# Altium schematic sheet S06_SOM2_C_D.SchDoc: SOM2 C & D
size 381 x 241 mm; SheetNumber: 6; SheetTotal: 12
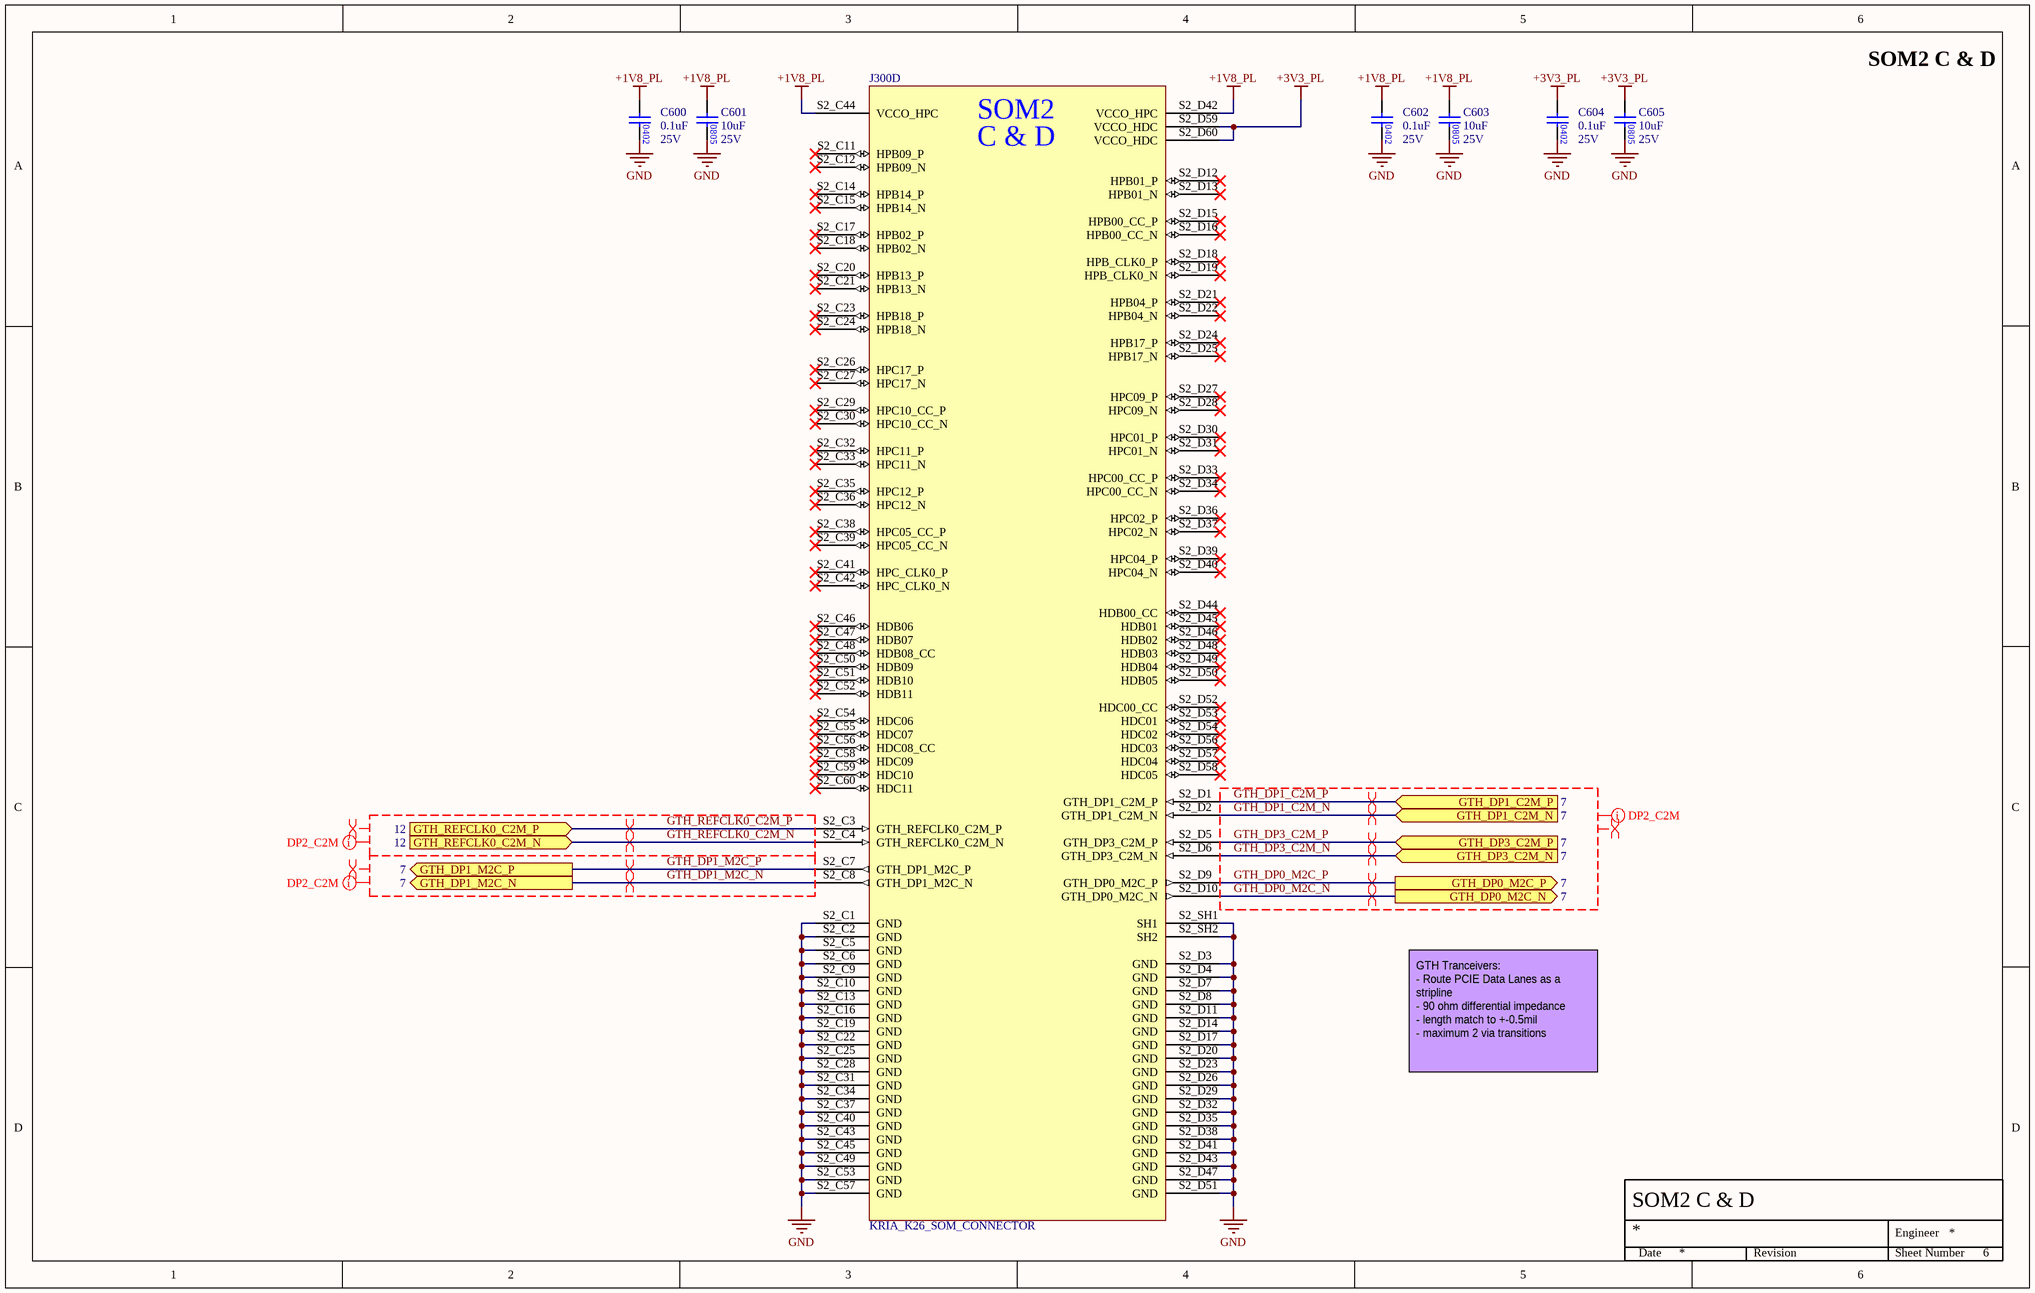
[diagram p0: S06_SOM2_C_D.SchDoc]

## Parts
C600  value 0.1uF  Voltage Rating: 25V  [CAP0402]  (hidden comment: CAP_0402)
C601  value 10uF  Voltage Rating: 25V  [CAP0805]  (hidden comment: CAP_0805)
C602  value 0.1uF  Voltage Rating: 25V  [CAP0402]  (hidden comment: CAP_0402)
C603  value 10uF  Voltage Rating: 25V  [CAP0805]  (hidden comment: CAP_0805)
C604  value 0.1uF  Voltage Rating: 25V  [CAP0402]  (hidden comment: CAP_0402)
C605  value 10uF  Voltage Rating: 25V  [CAP0805]  (hidden comment: CAP_0805)
J300  KRIA_K26_SOM_CONNECTOR  [KRIA_K26_SOM]  (part D of 4)

## Ports
GTH_DP0_M2C_N (out, see 7), GTH_DP0_M2C_P (out, see 7), GTH_DP1_C2M_N (in, see 7), GTH_DP1_C2M_P (in, see 7), GTH_DP1_M2C_N (out, see 7), GTH_DP1_M2C_P (out, see 7), GTH_DP3_C2M_N (in, see 7), GTH_DP3_C2M_P (in, see 7), GTH_REFCLK0_C2M_N (in, see 12), GTH_REFCLK0_C2M_P (in, see 12)

## Nets
+1V8_PL: C600.1 C601.1 C602.1 C603.1 J300.S2_C44(VCCO_HPC) J300.S2_D42(VCCO_HPC)
+3V3_PL: C604.1 C605.1 J300.S2_D59(VCCO_HDC) J300.S2_D60(VCCO_HDC)
GND: C600.2 C601.2 C602.2 C603.2 C604.2 C605.2 J300.S2_C1(GND) J300.S2_C2(GND) J300.S2_C5(GND) J300.S2_C6(GND) J300.S2_C9(GND) J300.S2_C10(GND) J300.S2_C13(GND) J300.S2_C16(GND) J300.S2_C19(GND) J300.S2_C22(GND) J300.S2_C25(GND) J300.S2_C28(GND) J300.S2_C31(GND) J300.S2_C34(GND) J300.S2_C37(GND) J300.S2_C40(GND) J300.S2_C43(GND) J300.S2_C45(GND) J300.S2_C49(GND) J300.S2_C53(GND) J300.S2_C57(GND) J300.S2_D3(GND) J300.S2_D4(GND) J300.S2_D7(GND) J300.S2_D8(GND) J300.S2_D11(GND) J300.S2_D14(GND) J300.S2_D17(GND) J300.S2_D20(GND) J300.S2_D23(GND) J300.S2_D26(GND) J300.S2_D29(GND) J300.S2_D32(GND) J300.S2_D35(GND) J300.S2_D38(GND) J300.S2_D41(GND) J300.S2_D43(GND) J300.S2_D47(GND) J300.S2_D51(GND) J300.S2_SH1(SH1) J300.S2_SH2(SH2)
GTH_DP0_M2C_N: J300.S2_D10(GTH_DP0_M2C_N) ; port GTH_DP0_M2C_N
GTH_DP0_M2C_P: J300.S2_D9(GTH_DP0_M2C_P) ; port GTH_DP0_M2C_P
GTH_DP1_C2M_N: J300.S2_D2(GTH_DP1_C2M_N) ; port GTH_DP1_C2M_N
GTH_DP1_C2M_P: J300.S2_D1(GTH_DP1_C2M_P) ; port GTH_DP1_C2M_P
GTH_DP1_M2C_N: J300.S2_C8(GTH_DP1_M2C_N) ; port GTH_DP1_M2C_N
GTH_DP1_M2C_P: J300.S2_C7(GTH_DP1_M2C_P) ; port GTH_DP1_M2C_P
GTH_DP3_C2M_N: J300.S2_D6(GTH_DP3_C2M_N) ; port GTH_DP3_C2M_N
GTH_DP3_C2M_P: J300.S2_D5(GTH_DP3_C2M_P) ; port GTH_DP3_C2M_P
GTH_REFCLK0_C2M_N: J300.S2_C4(GTH_REFCLK0_C2M_N) ; port GTH_REFCLK0_C2M_N
GTH_REFCLK0_C2M_P: J300.S2_C3(GTH_REFCLK0_C2M_P) ; port GTH_REFCLK0_C2M_P

Not connected (* = marked no-connect by the designer): J300 S2_C11(HPB09_P)* S2_C12(HPB09_N)* S2_C14(HPB14_P)* S2_C15(HPB14_N)* S2_C17(HPB02_P)* S2_C18(HPB02_N)* S2_C20(HPB13_P)* S2_C21(HPB13_N)* S2_C23(HPB18_P)* S2_C24(HPB18_N)* S2_C26(HPC17_P)* S2_C27(HPC17_N)* S2_C29(HPC10_CC_P)* S2_C30(HPC10_CC_N)* S2_C32(HPC11_P)* S2_C33(HPC11_N)* S2_C35(HPC12_P)* S2_C36(HPC12_N)* S2_C38(HPC05_CC_P)* S2_C39(HPC05_CC_N)* S2_C41(HPC_CLK0_P)* S2_C42(HPC_CLK0_N)* S2_C46(HDB06)* S2_C47(HDB07)* S2_C48(HDB08_CC)* S2_C50(HDB09)* S2_C51(HDB10)* S2_C52(HDB11)* S2_C54(HDC06)* S2_C55(HDC07)* S2_C56(HDC08_CC)* S2_C58(HDC09)* S2_C59(HDC10)* S2_C60(HDC11)* S2_D12(HPB01_P)* S2_D13(HPB01_N)* S2_D15(HPB00_CC_P)* S2_D16(HPB00_CC_N)* S2_D18(HPB_CLK0_P)* S2_D19(HPB_CLK0_N)* S2_D21(HPB04_P)* S2_D22(HPB04_N)* S2_D24(HPB17_P)* S2_D25(HPB17_N)* S2_D27(HPC09_P)* S2_D28(HPC09_N)* S2_D30(HPC01_P)* S2_D31(HPC01_N)* S2_D33(HPC00_CC_P)* S2_D34(HPC00_CC_N)* S2_D36(HPC02_P)* S2_D37(HPC02_N)* S2_D39(HPC04_P)* S2_D40(HPC04_N)* S2_D44(HDB00_CC)* S2_D45(HDB01)* S2_D46(HDB02)* S2_D48(HDB03)* S2_D49(HDB04)* S2_D50(HDB05)* S2_D52(HDC00_CC)* S2_D53(HDC01)* S2_D54(HDC02)* S2_D56(HDC03)* S2_D57(HDC04)* S2_D58(HDC05)*

## Layout directives
differential pair; differential pair class DIFFPAIR90: GTH_DP0_M2C_N, GTH_DP0_M2C_P, GTH_DP1_C2M_N, GTH_DP1_C2M_P, GTH_DP1_M2C_N, GTH_DP1_M2C_P, GTH_DP3_C2M_N, GTH_DP3_C2M_P
net class DIFFPAIR_GTH: GTH_DP0_M2C_N, GTH_DP0_M2C_P, GTH_DP1_C2M_N, GTH_DP1_C2M_P, GTH_DP1_M2C_N, GTH_DP1_M2C_P, GTH_DP3_C2M_N, GTH_DP3_C2M_P
differential pair: GTH_DP0_M2C_N, GTH_DP0_M2C_P, GTH_DP1_C2M_N, GTH_DP1_C2M_P, GTH_DP1_M2C_N, GTH_DP1_M2C_P, GTH_DP3_C2M_N, GTH_DP3_C2M_P, GTH_REFCLK0_C2M_N, GTH_REFCLK0_C2M_P
net class DIFFPAIR_REFCLK: GTH_REFCLK0_C2M_N, GTH_REFCLK0_C2M_P
differential pair; differential pair class DIFFPAIR100: GTH_REFCLK0_C2M_N, GTH_REFCLK0_C2M_P

## Notes on the sheet
- GTH Tranceivers:
  - Route PCIE Data Lanes as a stripline
  - 90 ohm differential impedance
  - length match to +-0.5mil
  - maximum 2 via transitions
- Engineer
- Date
- Revision
- Sheet Number
- (in symbol KRIA_K26_SOM, part D) SOM2; C & D

## Library data of the parts
C600 C602 C604 = CAP_CL05A104KA5NNNC: CAP CER 0.1UF 25V X5R 0402; Manufacturer: Samsung Electro-Mechanics; Tolerance: 10%; Manufacturer Part Number 1: CL05A104KA5NNNC; Case/Package: 0402; Mounting Type: Surface Mount; Temperature Coefficient: X5R
C601 C603 C605 = CAP_CL21A106KAYNNNE: CAP CER 10UF 25V X5R 0805; Manufacturer: Samsung Electro-Mechanics; Tolerance: 10%; Manufacturer Part Number 1: CL21A106KAYNNNE; Case/Package: 0805; Mounting Type: Surface Mount; Temperature Coefficient: X5R
J300 = KRIA_K26_SOM: 2 x 240 pos Samtec REF-226081-01; Number of Positions: 480; Manufacturer: Samtec; Manufacturer Part NUmber: REF-226081-01; Number of Rows: 8